# EAGLE schematic sn76489-simple-sound (EAGLE 9.6.2)
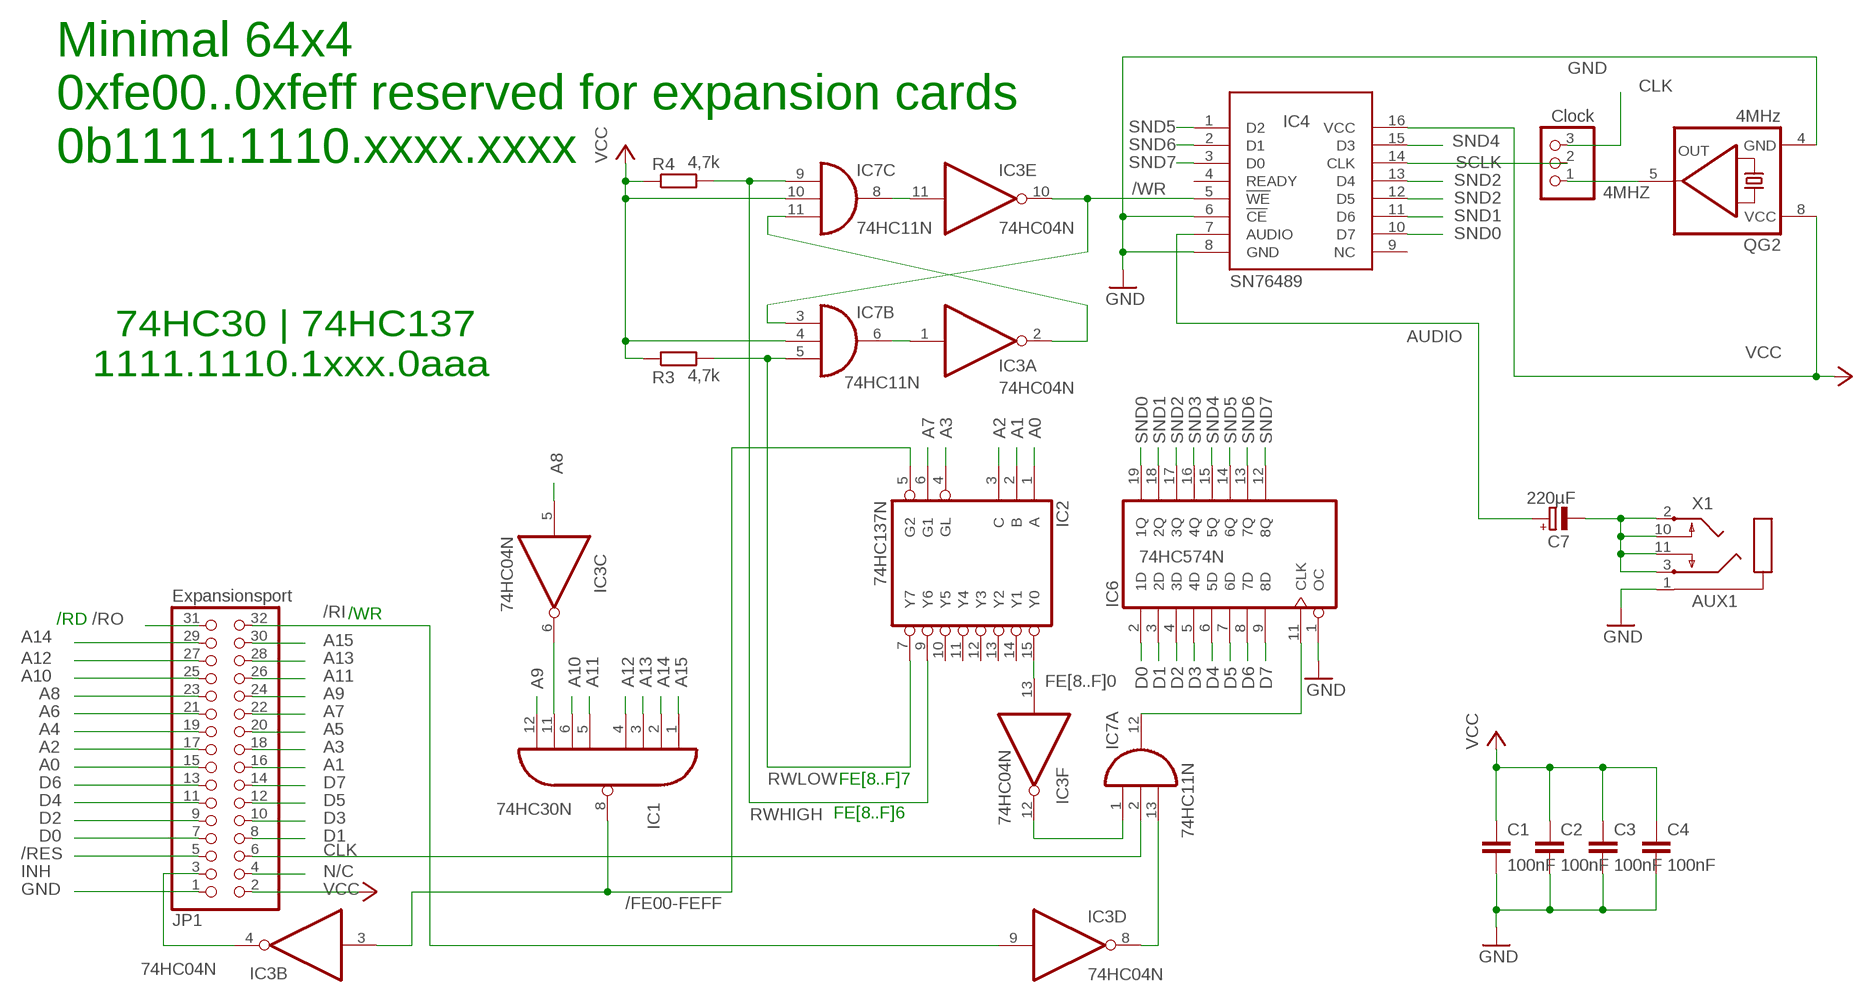
[diagram p0: schematic, sheet 1]

## Parts
C1  100nF  C-EU050-025X075  [C050-025X075]
C2  100nF  C-EU050-025X075  [C050-025X075]
C3  100nF  C-EU050-025X075  [C050-025X075]
C4  100nF  C-EU050-025X075  [C050-025X075]
C7  220µF  CPOL-EUE2.5-7  [E2,5-7]
IC1  74HC30N  [DIL14]
IC2  74HC137N  [DIL16]
IC3  74HC04N  [DIL14]
IC4  SN76489  ALEX-PARTS_SN76489AN  [ALEX-PARTS_DIL16]
IC6  74HC574N  [DIL20]
IC7  74HC11N  [DIL14]
JP1  Expansionsport  PINHD-2X16  [2X16]
JP6  Clock  PINHD-1X3  [1X03]
QG2  4MHz  QG5460  [DIL08S]
R3  4,7k  R-EU_0207/10  [0207/10]
R4  4,7k  R-EU_0207/10  [0207/10]
X1  AUX1  CON-SJ1-352XNSJ1-352XN  [SJ1-352XN]

## Nets
4MHZ: JP6.1 QG2.5(OUT)
/FE00-FEFF: IC1.8(O) IC2.5(G2) IC3.3(B:I)
/RES: JP1.5
/RI: IC3.9(D:I) JP1.32
/RO: JP1.31
/WR: IC3.10(E:O) IC4.5(!WE) IC7.3(B:I0)
A0: IC2.1(A) JP1.15
A1: IC2.2(B) JP1.16
A2: IC2.3(C) JP1.17
A3: IC2.4(GL) JP1.18
A4: JP1.19
A5: JP1.20
A6: JP1.21
A7: IC2.6(G1) JP1.22
A8: IC3.5(C:I) JP1.23
A9: IC1.12(I7) JP1.24
A10: IC1.6(I5) JP1.25
A11: IC1.5(I4) JP1.26
A12: IC1.4(I3) JP1.27
A13: IC1.3(I2) JP1.28
A14: IC1.2(I1) JP1.29
A15: IC1.1(I0) JP1.30
AUDIO: C7.+ IC4.7(AUDIO)
AUXOUT: C7.- X1.2 X1.3 X1.10 X1.11
CLK: IC7.2(A:I1) JP1.6 JP6.3
D0: IC6.2(1D) JP1.7
D1: IC6.3(2D) JP1.8
D2: IC6.4(3D) JP1.9
D3: IC6.5(4D) JP1.10
D4: IC6.6(5D) JP1.11
D5: IC6.7(6D) JP1.12
D6: IC6.8(7D) JP1.13
D7: IC6.9(8D) JP1.14
FE[8..F]0: IC2.15(Y0) IC3.13(F:I)
FEE0: IC3.12(F:O) IC7.1(A:I0)
GND [Power]: C1.2 C2.2 C3.2 C4.2 IC4.6(!CE) IC4.8(GND) IC6.1(OC) JP1.1 QG2.4(GND) X1.1
INH: IC3.4(B:O) JP1.3
N$1: IC1.11(I6) IC3.6(C:O)
N$3: IC3.11(E:I) IC7.8(C:O)
N$4: IC3.1(A:I) IC7.6(B:O)
N$6: IC3.2(A:O) IC7.11(C:I2)
N$18: IC6.11(CLK) IC7.12(A:O)
N$20: IC3.8(D:O) IC7.13(A:I2)
N/C: JP1.4
RWHIGH: IC2.9(Y6) IC7.9(C:I0) R4.2
RWLOW: IC2.7(Y7) IC7.5(B:I2) R3.2
SCLK: IC4.14(CLK) JP6.2
SND0: IC4.10(D7) IC6.19(1Q)
SND1: IC4.11(D6) IC6.18(2Q)
SND2: IC4.12(D5) IC4.13(D4) IC6.17(3Q)
SND3: IC6.16(4Q)
SND4: IC4.15(D3) IC6.15(5Q)
SND5: IC4.1(D2) IC6.14(6Q)
SND6: IC4.2(D1) IC6.13(7Q)
SND7: IC4.3(D0) IC6.12(8Q)
VCC [Power]: C1.1 C2.1 C3.1 C4.1 IC4.16(VCC) IC7.4(B:I1) IC7.10(C:I1) JP1.2 QG2.8(VCC) R3.1 R4.1
Unconnected: IC2.10(Y5) IC2.11(Y4) IC2.12(Y3) IC2.13(Y2) IC2.14(Y1) IC4.4(READY) IC4.9(NC)

## Notes on the sheet
- Minimal 64x4
  0xfe00..0xfeff reserved for expansion cards
  0b1111.1110.xxxx.xxxx
- 74HC30 | 74HC137
  1111.1110.1xxx.0aaa
- /WR
- /RD
- FE[8..F]7
- FE[8..F]6

## Power pins joined to a net without a drawn wire
GND: IC1.7(GND) IC2.8(GND) IC3.7(P:GND) IC6.10(GND) IC7.7(P:GND)
VCC: IC1.14(VCC) IC2.16(VCC) IC3.14(P:VCC) IC6.20(VCC) IC7.14(P:VCC)

## Library data of the parts
C1-C4 = rcl:C-EU: CAPACITOR, European symbol; SPICEPREFIX: C
C7 = rcl:CPOL-EU: POLARIZED CAPACITOR, European symbol; SPICEPREFIX: C
IC1 = 74xx-eu:74*30: 8-input NAND gate
IC2 = 74xx-eu:74*137: 3-line to 8-line DECODER/DEMULTIPLEXER, address LATCH
IC3 = 74xx-eu:74*04: Hex INVERTER
IC4 = squareinator2:ALEX-PARTS_SN76489AN: TI SN76489AN Sound Generator
IC6 = 74xx-eu:74*574: 8-bit D type FLIP FLOP bus driver
IC7 = 74xx-eu:74*11: Triple 3-input AND gate
JP1 = pinhead:PINHD-2X16: PIN HEADER
JP6 = pinhead:PINHD-1X3: PIN HEADER
QG2 = crystal:QG5460: CRYSTAL RESONATOR; OC_FARNELL: unknown; OC_NEWARK: unknown
R3 R4 = rcl:R-EU_: RESISTOR, European symbol; SPICEPREFIX: R
X1 = con-sj1-352xn:CON-SJ1-352XN: MIC/HEADPHONE JACK KS-S stereo microphone/headphone jack SJ1-352XN (CUD Devices)

## Net classes
0 default: width 0.254 mm
1 Power: width 0.457 mm